# Altium project RFID_P5.PrjPcb (part 2 of 2)

## Sheet Power_CU Schematic.SchDoc: Title
size A3; SheetTitle: Power Supply Schematic; ApprovalDate: dd/mm/yyyy; PageSetup: Record=PageOptions|CenterHorizontal=True|CenterVertical=True|PrintScale=1.01|XCorrection=1.00|YCorrection=1.00|PrintKind=1|BorderSize=5000000|LeftOffset=0|BottomOffset=0|Orientation=2|PaperLength=1000|PaperWidth=1000|Scale=100|PaperSource=7|PrintQuality=600|MediaType=1|DitherType=10|PaperKind=A3 (297 x 420mm)|PrintScaleMode=1; Title2: Power Schematic; Date: *******; ApprovedBy: *******; CheckedBy: None; Author: *******; CompanyName: *******; DrawnBy: Name; Engineer: *******; Organization: *******; Address1: *******; Address2: *******; Address3: *******; Address4: *******; DocumentNumber: Doc Num; Revision: *******; SheetNumber: 1; SheetTotal: *******; CurrentTime: *******; CurrentDate: *******; Time: *******; DocumentFullPathAndName: *******; DocumentName: *******; ModifiedDate: *******; ImagePath: *******; ProjectName: *******; Application_BuildNumber: *******
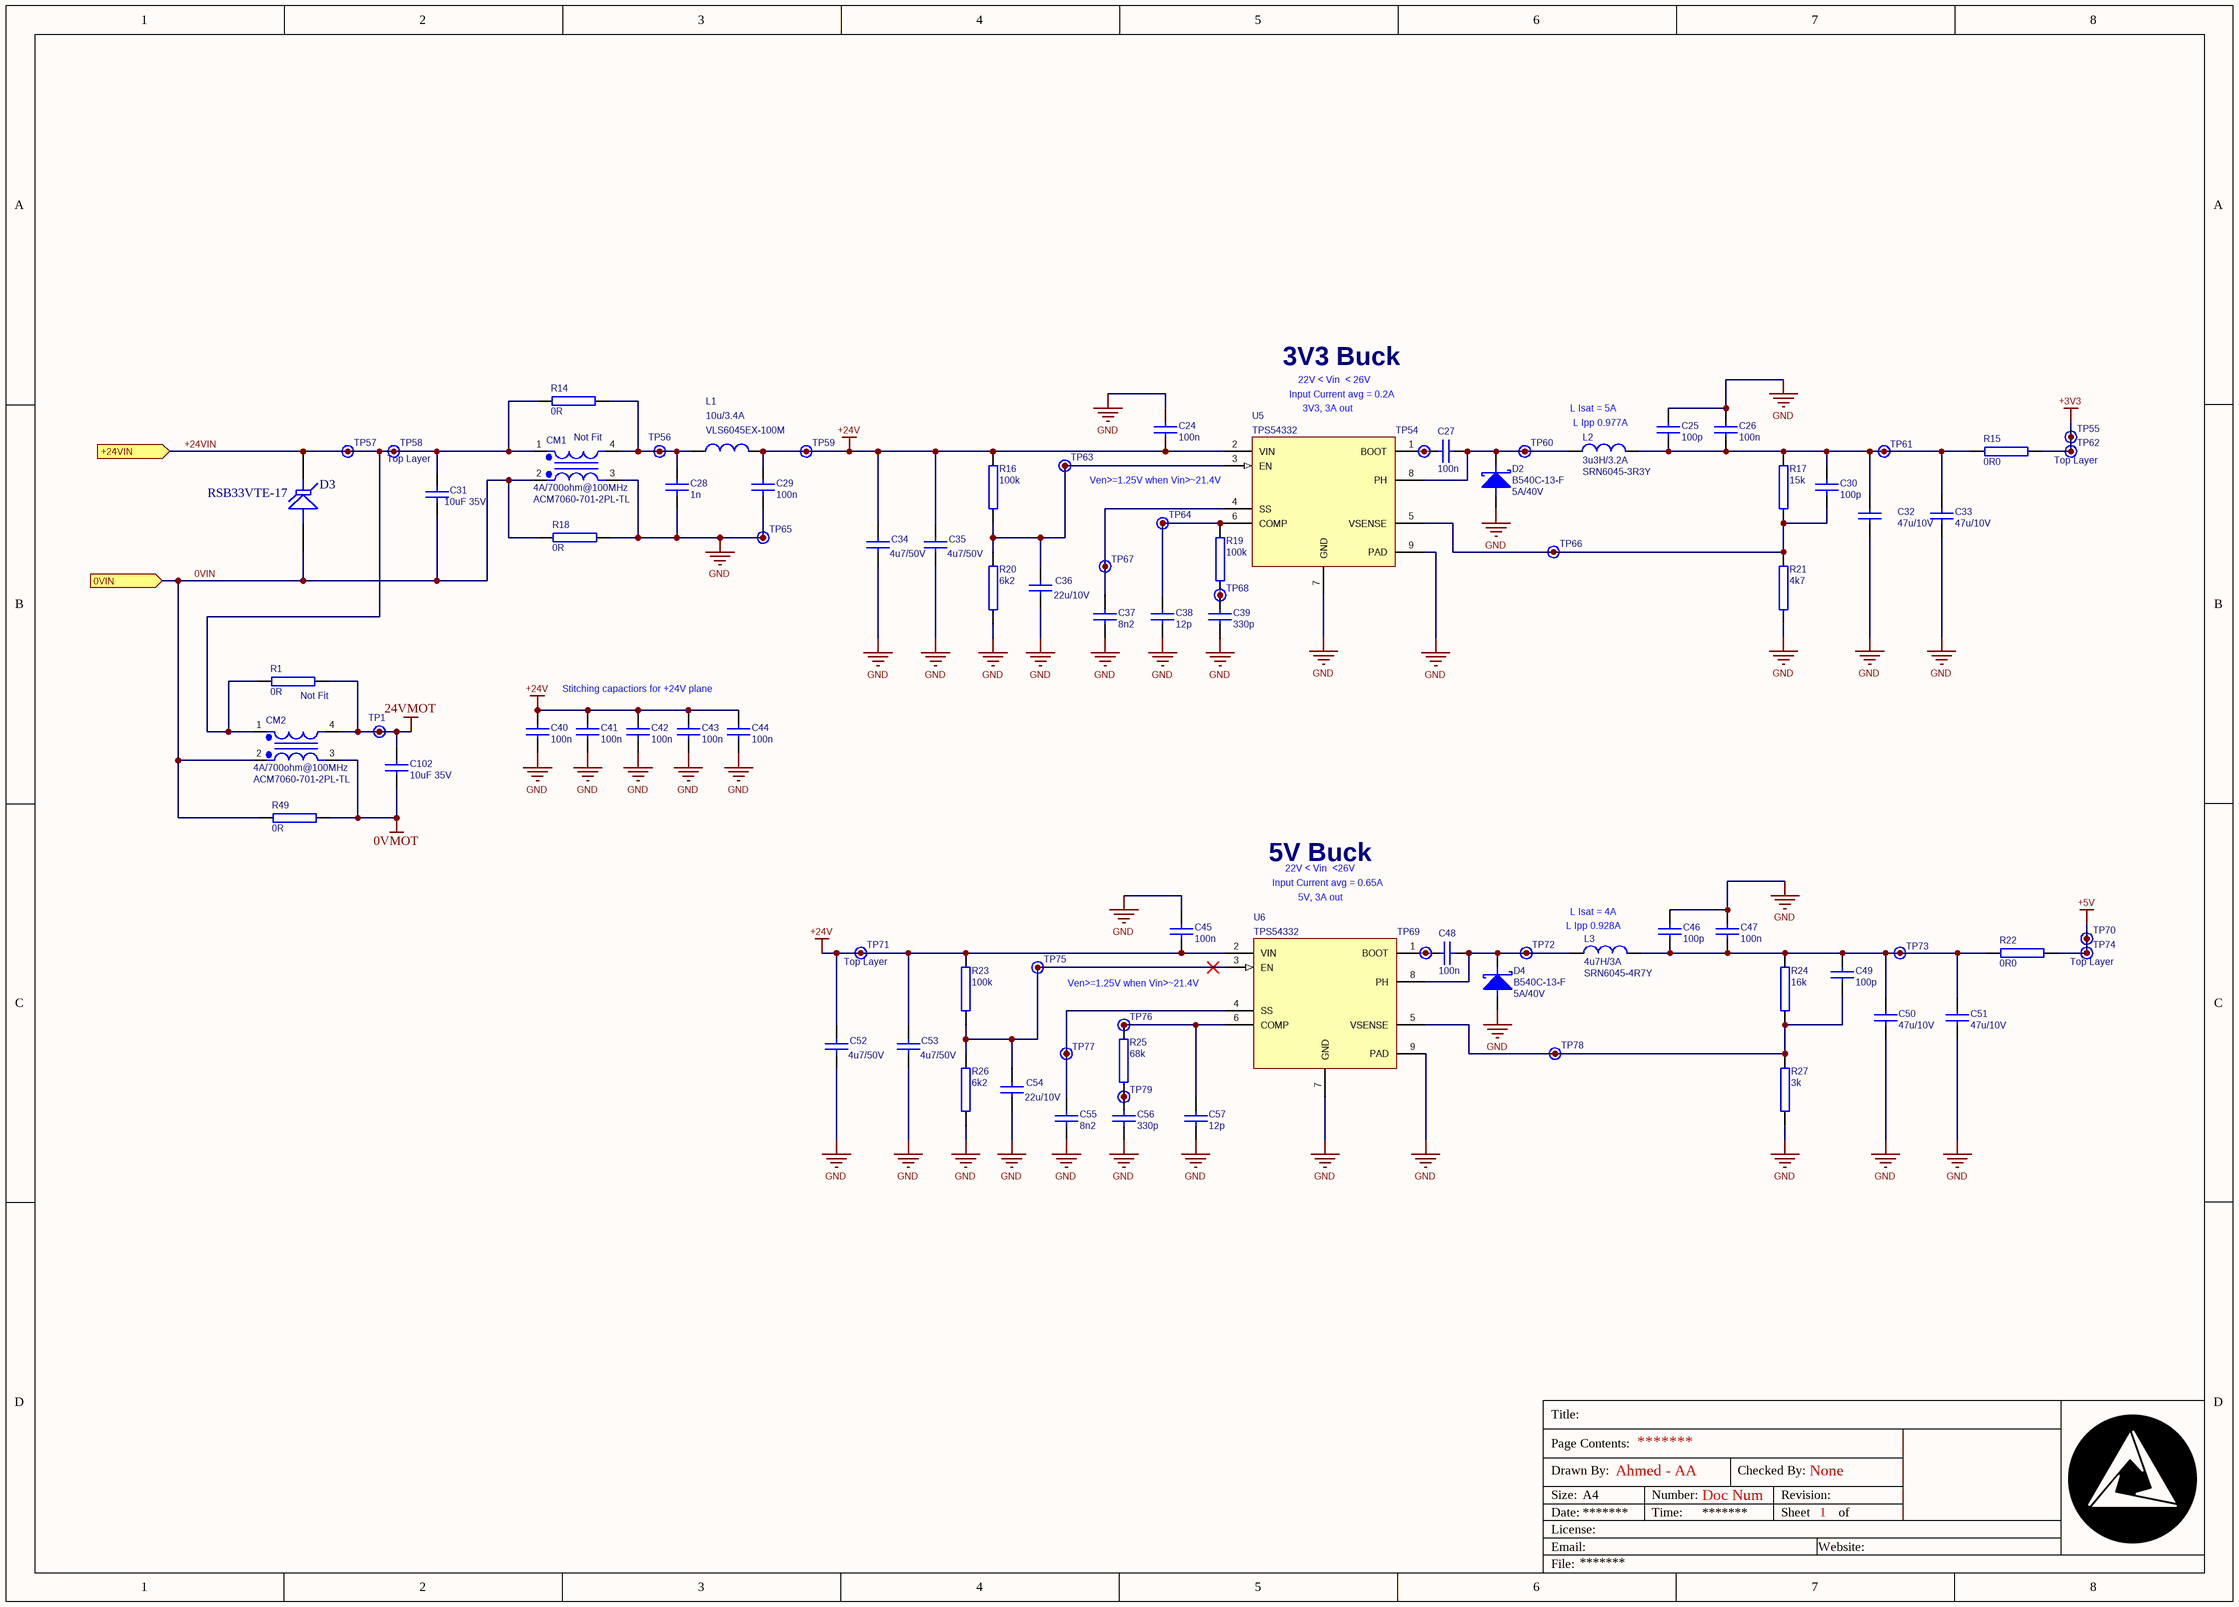
[diagram p4: Power_CU Schematic.SchDoc]

### Parts
C24  100n  [CAPC1608X09N(0603)]
C25  100p  [CAPC1608X09N(0603)]
C26  100n  [CAPC1608X09N(0603)]
C27  100n  [CAPC1608X09N(0603)]
C28  1n  [CAPC1608X09N(0603)]
C29  100n  [CAPC1608X09N(0603)]
C30  100p  [CAPC1608X09N(0603)]
C31  10uF 35V  [CAPC1608X09N(0603)]
C32  47u/10V  [CAPC2012X13N(0805)]
C33  47u/10V  [CAPC2012X13N(0805)]
C34  04 Value: 4u7/50V  [CAPC3216X16N(1206)]  (hidden comment: Cin)
C35  04 Value: 4u7/50V  [CAPC3216X16N(1206)]  (hidden comment: Cin)
C36  22u/10V  [CAPC1608X09N(0603)]
C37  8n2  [CAPC1608X09N(0603)]
C38  12p  [CAPC1608X09N(0603)]
C39  330p  [CAPC1608X09N(0603)]
C40  100n  [CAPC1608X09N(0603)]
C41  100n  [CAPC1608X09N(0603)]
C42  100n  [CAPC1608X09N(0603)]
C43  100n  [CAPC1608X09N(0603)]
C44  100n  [CAPC1608X09N(0603)]
C45  100n  [CAPC1608X09N(0603)]
C46  100p  [CAPC1608X09N(0603)]
C47  100n  [CAPC1608X09N(0603)]
C48  100n  [CAPC1608X09N(0603)]
C49  100p  [CAPC1608X09N(0603)]
C50  47u/10V  [CAPC2012X13N(0805)]
C51  47u/10V  [CAPC2012X13N(0805)]
C52  04 Value: 4u7/50V  [CAPC3216X16N(1206)]  (hidden comment: Cin)
C53  04 Value: 4u7/50V  [CAPC3216X16N(1206)]  (hidden comment: Cin)
C54  22u/10V  [CAPC1608X09N(0603)]
C55  8n2  [CAPC1608X09N(0603)]
C56  330p  [CAPC1608X09N(0603)]
C57  12p  [CAPC1608X09N(0603)]
C102  10uF 35V  [CAPC1608X09N(0603)]
CM1  4A/700ohm@100MHz  07 Assembly Options: Not Fit  [ACM7060-701-2PL-TL]
CM2  4A/700ohm@100MHz  07 Assembly Options: Not Fit  [ACM7060-701-2PL-TL]
D2  B540C-13-F  04 Value: 5A/40V  [B540C]
D3  RSB33VTE-17  [425]
D4  B540C-13-F  04 Value: 5A/40V  [B540C]
L1  10u/3.4A  02 Part Number: VLS6045EX-100M  [VLP6045LT-100M]
L2  3u3H/3.2A  [SRN6045-1R0Y]
L3  4u7H/3A  [SRN6045-1R0Y]
R1  0R  [RESC3116X07N(1206)]
R14  0R  [RESC3116X07N(1206)]
R15  0R0  [RESC1608X06N(0603)]
R16  100k  [RESC1608X06N(0603)]
R17  15k  [RESC1608X06N(0603)]
R18  0R  [RESC3116X07N(1206)]
R19  100k  [RESC1608X06N(0603)]
R20  6k2  [RESC1608X06N(0603)]
R21  4k7  [RESC1608X06N(0603)]
R22  0R0  [RESC1608X06N(0603)]
R23  100k  [RESC1608X06N(0603)]
R24  16k  [RESC1608X06N(0603)]
R25  68k  [RESC1608X06N(0603)]
R26  6k2  [RESC1608X06N(0603)]
R27  3k  [RESC1608X06N(0603)]
R49  0R  [RESC3116X07N(1206)]
TP1  LFX_P  [Test Point 1mm]  (value not drawn)  (no BOM)
TP54  LFX_P  [Test Point 1mm]  (value not drawn)  (no BOM)
TP55  LFX_P  [Test Point 1mm]  (value not drawn)  (no BOM)
TP56  LFX_P  [Test Point 1mm]  (value not drawn)  (no BOM)
TP57  LFX_P  [Test Point 1mm]  (value not drawn)  (no BOM)
TP58  Notes: Top Layer  [Test Point 1mm]  (hidden comment: LFX_P)  (no BOM)
TP59  LFX_P  [Test Point 1mm]  (value not drawn)  (no BOM)
TP60  LFX_P  [Test Point 1mm]  (value not drawn)  (no BOM)
TP61  LFX_P  [Test Point 1mm]  (value not drawn)  (no BOM)
TP62  Notes: Top Layer  [Test Point 1mm]  (hidden comment: LFX_P)  (no BOM)
TP63  LFX_P  [Test Point 1mm]  (value not drawn)  (no BOM)
TP64  LFX_P  [Test Point 1mm]  (value not drawn)  (no BOM)
TP65  LFX_P  [Test Point 1mm]  (value not drawn)  (no BOM)
TP66  LFX_P  [Test Point 1mm]  (value not drawn)  (no BOM)
TP67  LFX_P  [Test Point 1mm]  (value not drawn)  (no BOM)
TP68  LFX_P  [Test Point 1mm]  (value not drawn)  (no BOM)
TP69  LFX_P  [Test Point 1mm]  (value not drawn)  (no BOM)
TP70  LFX_P  [Test Point 1mm]  (value not drawn)  (no BOM)
TP71  Notes: Top Layer  [Test Point 1mm]  (hidden comment: LFX_P)  (no BOM)
TP72  LFX_P  [Test Point 1mm]  (value not drawn)  (no BOM)
TP73  LFX_P  [Test Point 1mm]  (value not drawn)  (no BOM)
TP74  Notes: Top Layer  [Test Point 1mm]  (hidden comment: LFX_P)  (no BOM)
TP75  LFX_P  [Test Point 1mm]  (value not drawn)  (no BOM)
TP76  LFX_P  [Test Point 1mm]  (value not drawn)  (no BOM)
TP77  LFX_P  [Test Point 1mm]  (value not drawn)  (no BOM)
TP78  LFX_P  [Test Point 1mm]  (value not drawn)  (no BOM)
TP79  LFX_P  [Test Point 1mm]  (value not drawn)  (no BOM)
U5  TPS54332  [SOIC127P600X170_HS-9N_b]
U6  TPS54332  [SOIC127P600X170_HS-9N_b]

### Ports
0VIN (in), +24VIN (in)

### Nets
0VMOT: C102.1 CM2.3 R49.2
24VMOT: C102.2 CM2.4 R1.2 TP1.TP
+3V3: R15.2 TP55.TP TP62.TP
+5V: R22.2 TP70.TP TP74.TP
+24V: C24.2 C29.1 C34.2 C35.2 C40.1 C41.1 C42.1 C43.1 C44.1 C45.2 C52.2 C53.2 L1.2 R16.2 R23.2 TP59.TP TP71.TP U5.2(VIN) U6.2(VIN)
GND: C24.1 C25.1 C26.1 C28.1 C29.2 C32.1 C33.1 C34.1 C35.1 C36.1 C37.1 C38.1 C39.1 C40.2 C41.2 C42.2 C43.2 C44.2 C45.1 C46.1 C47.1 C50.1 C51.1 C52.1 C53.1 C54.1 C55.1 C56.1 C57.1 CM1.3 D2.A D4.A R18.2 R20.1 R21.1 R26.1 R27.1 TP65.TP U5.7(GND) U5.9(PAD) U6.7(GND) U6.9(PAD)  [project net AN GND]
0VIN: C31.1 CM1.2 CM2.2 D3.1(A) R18.1 R49.1 ; port 0VIN
+24VIN: C31.2 CM1.1 CM2.1 D3.2(K) R1.1 R14.1 TP57.TP TP58.TP ; port +24VIN
NetC25_2: C25.2 C26.2 C30.1 C32.2 C33.2 L2.2 R15.1 R17.2 TP61.TP
NetC27_1: C27.1 D2.K L2.1 TP60.TP U5.8(PH)
NetC27_2: C27.2 TP54.TP U5.1(BOOT)
NetC28_2: C28.2 CM1.4 L1.1 R14.2 TP56.TP
NetC30_2: C30.2 R17.1 R21.2 TP66.TP U5.5(VSENSE)
NetC36_2: C36.2 R16.1 R20.2 TP63.TP U5.3(EN)
NetC37_2: C37.2 TP67.TP U5.4(SS)
NetC38_2: C38.2 R19.2 TP64.TP U5.6(COMP)
NetC39_2: C39.2 R19.1 TP68.TP
NetC46_2: C46.2 C47.2 C49.1 C50.2 C51.2 L3.2 R22.1 R24.2 TP73.TP
NetC48_1: C48.1 D4.K L3.1 TP72.TP U6.8(PH)
NetC48_2: C48.2 TP69.TP U6.1(BOOT)
NetC49_2: C49.2 R24.1 R27.2 TP78.TP U6.5(VSENSE)
NetC54_2: C54.2 R23.1 R26.2 TP75.TP U6.3(EN)
NetC55_2: C55.2 TP77.TP U6.4(SS)
NetC56_2: C56.2 R25.1 TP79.TP
NetC57_2: C57.2 R25.2 TP76.TP U6.6(COMP)

### Notes on the sheet
- 22V < Vin  < 26V
- 3V3 Buck
- Input Current avg = 0.2A
- Ven>=1.25V when Vin>~21.4V
- (near U5) 3V3, 3A out
- L Isat = 5A
- L Ipp 0.977A
- Stitching capactiors for +24V plane
- 5V Buck
- (near U6) 5V, 3A out
- 22V < Vin  <26V
- Input Current avg = 0.65A
- L Isat = 4A
- (near L3) L Ipp 0.928A
- Title:
- Drawn By:
- Page Contents:
- Ahmed - AA
- Checked By:
- Size:
- Date:
- File:
- License:
- Email:
- A4
- Number:
- Time:
- Revision:
- Sheet
- Website:
- of

### Library data of the parts
C24 C26 C27 C29 C40-C45 C47 C48 = GRM188R71H104KA93D: as C62 on sheet RFID_CU Schematic; 02 Part Number: GRM188R71H104KA93D; 03 Description: Capacitor, Ceramic, 50V, ±10%, X7R, -55°C to 125°C; 04 Value: 100n; 01 Part Category: Capacitor; 09 Digikey PN: 490-1519-2-ND; ComponentLink1Description: Datasheet; ComponentLink1URL: L:\Datasheet\Capacitor\c02e.pdf
C25 C30 C46 C49 = GRM1885C1H101JA01D: Capacitor, Ceramic, 50V, ±5%, C0G NP0, -55°C to 125°C; 08 Manufacturer: Murata Electronics North America; 06 Package: 0603; 12 Author: D.Grace; 05 Footprint Type: SMD; 02 Part Number: GRM1885C1H101JA01D; 03 Description: Capacitor, Ceramic, 50V, ±5%, C0G NP0, -55°C to 125°C; 04 Value: 100p; 01 Part Category: Capacitor; 09 Digikey PN: 490-1427-2-ND; 10 Alternate Supplier: Mouser; 11 Alternate Supplier PN: 81-GRM39C101J50; ComponentLink1Description: Datasheet; ComponentLink1URL: L:\Datasheet\Capacitor\c02e.pdf
C28 = GRM1885C1H102JA01D: as C12 on sheet MCU_CU Schematic; 02 Part Number: GRM1885C1H102JA01D; 03 Description: Capacitor, Ceramic, 50V, ±5%, C0G NP0, -55°C to 125°C; 04 Value: 1n; 01 Part Category: Capacitor; 09 Digikey PN: 490-1451-2-ND; ComponentLink1Description: Datasheet; ComponentLink1URL: L:\Datasheet\Capacitor\c02e.pdf
C31 = GRM1885C1H102JA01D: Capacitor, Ceramic, 50V, ±20%,; 06 Package: 0603; 12 Author: D.Grace; 05 Footprint Type: SMD; 02 Part Number: GRM1885C1H102JA01D; 03 Description: Capacitor, Ceramic, 50V, ±20%; 04 Value: 10uF; 01 Part Category: Capacitor; ComponentLink1Description: Datasheet
C32 C33 C50 C51 = C2012X5R1A476M125AC: Capacitor, Ceramic, 10V, ±20%, X5R, -55°C to 85°C; 08 Manufacturer: TDK; 04 Value: 47u; 06 Package: 0805; 12 Author: K.Sukumar; 05 Footprint Type: SMD; 02 Part Number: C2012X5R1A476M125AC; 03 Description: Capacitor, Ceramic, 10V, ±20%, X5R, -55°C to 85°C; 01 Part Category: Capacitor; 09 Digikey PN: 445-8239-2-ND; ComponentLink1Description: Datasheet; ComponentLink1URL: L:\Datasheet\Capacitor\mlcc_commercial_general_en.pdf
C34 C35 C52 C53 = GRM31CR71H475KA12L: Capacitor, Ceramic, 50V, ±10%, X7R, -55°C to 125°C; 08 Manufacturer: Murata Electronics North America; 06 Package: 1206; 12 Author: D.Grace; 05 Footprint Type: SMD; 02 Part Number: GRM31CR71H475KA12L; 03 Description: Capacitor, Ceramic, 50V, ±10%, X7R, -55°C to 125°C; 01 Part Category: Capacitor; 09 Digikey PN: 490-6521-2-ND; ComponentLink1Description: Datasheet; ComponentLink1URL: L:\Datasheet\Capacitor\c02e.pdf
C36 C54 = C1608X5R1A226M080AC: Capacitor, Ceramic, 10V, ±20%, X5R, -55°C to 85°C; 08 Manufacturer: TDK Corporation; 04 Value: 22u; 06 Package: 0603; 12 Author: K.Sukumar; 05 Footprint Type: SMD; 02 Part Number: C1608X5R1A226M080AC; 03 Description: Capacitor, Ceramic, 10V, ±20%, X5R, -55°C to 85°C; 01 Part Category: Capacitor; 09 Digikey PN: 445-9077-2-ND; ComponentLink1Description: Datasheet; ComponentLink1URL: L:\Datasheet\Capacitor\mlcc_commercial_general_en.pdf
C37 C55 = GRM188R71H822KA01D: Capacitor, Ceramic, 50V, ±10%, X7R, -55°C to 125°C; 08 Manufacturer: Murata Electronics North America; 06 Package: 0603; 12 Author: D.Grace; 05 Footprint Type: SMD; 02 Part Number: GRM188R71H822KA01D; 03 Description: Capacitor, Ceramic, 50V, ±10%, X7R, -55°C to 125°C; 04 Value: 8n2; 01 Part Category: Capacitor; 09 Digikey PN: 490-1510-2-ND; 10 Alternate Supplier: Mouser; 11 Alternate Supplier PN: 81-GRM39X822K50D; ComponentLink1Description: Datasheet; ComponentLink1URL: L:\Datasheet\Capacitor\c02e.pdf
C38 C57 = GRM1885C1H120JA01D: Capacitor, Ceramic, 50V, ±5%, C0G NP0, -55°C to 125°C; 08 Manufacturer: Murata Electronics North America; 06 Package: 0603; 12 Author: D.Grace; 05 Footprint Type: SMD; 02 Part Number: GRM1885C1H120JA01D; 03 Description: Capacitor, Ceramic, 50V, ±5%, C0G NP0, -55°C to 125°C; 04 Value: 12p; 01 Part Category: Capacitor; 09 Digikey PN: 490-1405-2-ND; 10 Alternate Supplier: Mouser; 11 Alternate Supplier PN: 81-GRM39C120J50; ComponentLink1Description: Datasheet; ComponentLink1URL: L:\Datasheet\Capacitor\c02e.pdf
C39 C56 = GRM188R71H331KA01D: Capacitor, Ceramic, 50V, ±10%, X7R, -55°C to 125°C; 08 Manufacturer: Murata Electronics North America; 06 Package: 0603; 12 Author: M.Fineschi; 05 Footprint Type: SMD; 02 Part Number: GRM188R71H331KA01D; 03 Description: Capacitor, Ceramic, 50V, ±10%, X7R, -55°C to 125°C; 04 Value: 330p; 01 Part Category: Capacitor; 09 Digikey PN: 490-1486-1-ND; ComponentLink1Description: Datasheet; ComponentLink1URL: L:\Datasheet\Capacitor\c02e.pdf
C102 = GRM1885C1H102JA01D: Capacitor, Ceramic, 50V, ±5%, C0G NP0, -55°C to 125°C; 03 Description: Capacitor, Ceramic, 35V, ±20%; 06 Package: 0603; 05 Footprint Type: SMD; 04 Value: 10uF 35V; 01 Part Category: Capacitor; ComponentLink1Description: Datasheet
CM1 CM2 = ACM7060-701-2PL-TL: Common Mode Choke, 4A, 500ohm min 700ohm typ @100MHz, 15mOhm Max,; 01 Part Category: Filter; 08 Manufacturer: TDK Corporation; 06 Package: 7x6x3.5mm; 05 Footprint Type: SMD; 12 Author: D.Grace; 03 Description: Common Mode Choke, 4A, 500ohm min 700ohm typ @100MHz, 15mOhm Max,; 04 Value: 700ohm@100MHz; ComponentLink1Description: Datasheet; ComponentLink1URL: L:\Datasheet\Filter\ACM Series.pdf; 02 Part Number: ACM7060-701-2PL-TL; 09 Digikey PN: 445-2215-2-ND
D2 D4 = B540C-13-F: Diode, Schottky, Fast Recovery, 550mV @ 5A, 40V, 5A,  500ns, -55°C - +125°C; 01 Part Category: Protection; 08 Manufacturer: Diodes Inc; 06 Package: SMC; 05 Footprint Type: SMD; 12 Author: J.McLachlan; 03 Description: Diode, Schottky, Fast Recovery, 550mV @ 5A, 40V, 5A,  500ns, -55°C - +125°C; ComponentLink1Description: Datasheet; ComponentLink1URL: L:\Datasheet\Protection\ds13012.pdf; 09 Digikey PN: B540C-FDITR-ND; 02 Part Number: B540C-13-F
D3 = Tranzorb: Transient Voltage Suppression (TVS) Diode; Published: 24-Mar-1999; LatestRevisionDate: 17-Jul-2002; LatestRevisionNote: Re-released for DXP Platform.; PackageReference: DO-7; Publisher: Altium Limited; PackageDescription: Axial Lead Diode
L1 = VLP6045LT-100M: Inductor, 10µH , 3.4A rated, 3.9A Saturation,61mOhm; 08 Manufacturer: TDK Corporation; 04 Value: 10uH; 06 Package: Custom; 05 Footprint Type: SMD; 12 Author: M.Fineschi; 03 Description: Inductor, 10µH , 3.4A rated, 3.9A Saturation, 61mOhm; 01 Part Category: Inductor; ComponentLink1Description: Datasheet; ComponentLink1URL: https://product.tdk.com/info/en/catalog/datasheets/inductor_commercial_power_vls6045ex_en.pdf; 09 Digikey PN: 445-173039-1-ND
L2 = SRN6045-3R3Y: Inductor, 3u3H , I = 3.2A, 30.2mOhm, SRF 27MHz, ±30%, 5A Saturation; 01 Part Category: Passive; 08 Manufacturer: Bourns Inc; 06 Package: 6mm x 6mm; 05 Footprint Type: SMD; 12 Author: J.McLachlan; 03 Description: Inductor, 3u3H , I = 3.2A, 30.2mOhm, SRF 27MHz, ±30%, 5A Saturation; 04 Value: 3u3H; ComponentLink1Description: Datasheet; ComponentLink1URL: L:\Datasheet\Inductor\SRN6045.pdf; 09 Digikey PN: SRN6045-3R3YTR-ND; 02 Part Number: SRN6045-3R3Y
L3 = SRN6045-4R7Y: Inductor, 4u7H , I = 3A, 37.6mOhm, SRF 22MHz, ±30%, 4A Saturation; 01 Part Category: Passive; 08 Manufacturer: Bourns Inc; 06 Package: 6mm x 6mm; 05 Footprint Type: SMD; 12 Author: J.McLachlan; 03 Description: Inductor, 4u7H , I = 3A, 37.6mOhm, SRF 22MHz, ±30%, 4A Saturation; 04 Value: 4u7H; ComponentLink1Description: Datasheet; ComponentLink1URL: L:\Datasheet\Inductor\SRN6045.pdf; 09 Digikey PN: SRN6045-4R7YTR-ND; 02 Part Number: SRN6045-4R7Y
R1 R14 R18 R49 = RC1206JR-070RL: Resistor, Thick Film, 0.25W, ±1%, ±100ppm/°C; 08 Manufacturer: Yageo; 06 Package: 1206; 12 Author: M.Fineschi; 05 Footprint Type: SMD; 03 Description: Resistor, Thick Film, 0.25W, ±1%, ±100ppm/°C; 04 Value: 0R; 09 Digikey PN: 311-0.0ERTR-ND; 01 Part Category: Resistor; ComponentLink1Description: Datasheet; ComponentLink1URL: L:\Datasheet\Resistor\PYu-RC1206_51_RoHS_L-4.pdf; 02 Part Number: RC1206JR-070RL
R15 R22 = RC1608J000CS: Resistor, Thick Film, 0.1W, ±1%, ±100ppm/°C; 08 Manufacturer: Samsung Electro-Mechanics; 13 Reviewed By: P.Moutzouris; 06 Package: 0603; 12 Author: K.Sukumar; 05 Footprint Type: SMD; 02 Part Number: RC1608J000CS; 03 Description: Resistor, Thick Film, 0.1W, ±1%, ±100ppm/°C; 04 Value: 0R0; 09 Digikey PN: 1276-3510-2-ND; 01 Part Category: Resistor; ComponentLink1Description: Datasheet; ComponentLink1URL: L:\Datasheet\Resistor\Chip_Resistor.pdf
R16 R19 R23 = RC0603FR-07100KL: Resistor, Thick Film, 0.1W, ±1%, ±100ppm/°C; 08 Manufacturer: Yageo; 13 Reviewed By: P.Moutzouris; 06 Package: 0603; 12 Author: D.Grace; 05 Footprint Type: SMD; 02 Part Number: RC0603FR-07100KL; 03 Description: Resistor, Thick Film, 0.1W, ±1%, ±100ppm/°C; 04 Value: 100k; 01 Part Category: Resistor; ComponentLink1Description: Datasheet; ComponentLink1URL: L:\Datasheet\Resistor\PYu-RC0603_51_RoHS_L_4.pdf
  R16 R23: 09 Digikey PN: P100KLCT-ND
  R19: 09 Digikey PN: 311-100KHRTR-ND
R17 = RC0603FR-0715KL: Resistor, Thick Film, 0.1W, ±1%, ±100ppm/°C; 08 Manufacturer: Yageo; 13 Reviewed By: P.Moutzouris; 06 Package: 0603; 12 Author: D.Grace; 05 Footprint Type: SMD; 02 Part Number: RC0603FR-0715KL; 03 Description: Resistor, Thick Film, 0.1W, ±1%, ±100ppm/°C; 04 Value: 15k; 09 Digikey PN: 311-15.0KHRTR-ND; 01 Part Category: Resistor; ComponentLink1Description: Datasheet; ComponentLink1URL: L:\Datasheet\Resistor\PYu-RC0603_51_RoHS_L_4.pdf
R20 R26 = RC0603FR-076K2L: Resistor, Thick Film, 0.1W, ±1%, ±100ppm/°C; 08 Manufacturer: Yageo; 13 Reviewed By: P.Moutzouris; 06 Package: 0603; 12 Author: D.Grace; 05 Footprint Type: SMD; 02 Part Number: RC0603FR-076K2L; 03 Description: Resistor, Thick Film, 0.1W, ±1%, ±100ppm/°C; 04 Value: 6k2; 09 Digikey PN: 311-6.20KHRTR-ND; 01 Part Category: Resistor; ComponentLink1Description: Datasheet; ComponentLink1URL: L:\Datasheet\Resistor\PYu-RC0603_51_RoHS_L_4.pdf
R21 = RC0603FR-074K7L: Resistor, Thick Film, 0.1W, ±1%, ±100ppm/°C; 08 Manufacturer: Yageo; 13 Reviewed By: P.Moutzouris; 06 Package: 0603; 12 Author: D.Grace; 05 Footprint Type: SMD; 02 Part Number: RC0603FR-074K7L; 03 Description: Resistor, Thick Film, 0.1W, ±1%, ±100ppm/°C; 04 Value: 4k7; 09 Digikey PN: 311-4.70KHRTR-ND; 01 Part Category: Resistor; ComponentLink1Description: Datasheet; ComponentLink1URL: L:\Datasheet\Resistor\PYu-RC0603_51_RoHS_L_4.pdf
R24 = RC0603FR-0716KL: Resistor, Thick Film, 0.1W, ±1%, ±100ppm/°C; 08 Manufacturer: Yageo; 13 Reviewed By: P.Moutzouris; 06 Package: 0603; 12 Author: D.Grace; 05 Footprint Type: SMD; 02 Part Number: RC0603FR-0716KL; 03 Description: Resistor, Thick Film, 0.1W, ±1%, ±100ppm/°C; 04 Value: 16k; 09 Digikey PN: 311-16.0KHRTR-ND; 01 Part Category: Resistor; ComponentLink1Description: Datasheet; ComponentLink1URL: L:\Datasheet\Resistor\PYu-RC0603_51_RoHS_L_4.pdf
R25 = RC0603FR-0768KL: Resistor, Thick Film, 0.1W, ±1%, ±100ppm/°C; 08 Manufacturer: Yageo; 13 Reviewed By: P.Moutzouris; 06 Package: 0603; 12 Author: D.Grace; 05 Footprint Type: SMD; 02 Part Number: RC0603FR-0768KL; 03 Description: Resistor, Thick Film, 0.1W, ±1%, ±100ppm/°C; 04 Value: 68k; 09 Digikey PN: 311-68.0KHRTR-ND; 01 Part Category: Resistor; ComponentLink1Description: Datasheet; ComponentLink1URL: L:\Datasheet\Resistor\PYu-RC0603_51_RoHS_L_4.pdf
R27 = RC0603FR-073KL: Resistor, Thick Film, 0.1W, ±1%, ±100ppm/°C; 08 Manufacturer: Yageo; 13 Reviewed By: P.Moutzouris; 06 Package: 0603; 12 Author: D.Grace; 05 Footprint Type: SMD; 02 Part Number: RC0603FR-073KL; 03 Description: Resistor, Thick Film, 0.1W, ±1%, ±100ppm/°C; 04 Value: 3k; 09 Digikey PN: 311-3.00KHRTR-ND; 01 Part Category: Resistor; ComponentLink1Description: Datasheet; ComponentLink1URL: L:\Datasheet\Resistor\PYu-RC0603_51_RoHS_L_4.pdf
TP1 TP54-TP79 = Test Point: 01 Part Category: PCB; 12 Author: D.Grace
U5 U6 = TPS54332: Step Down, Adjustable, Vomin = 0.8V, Vin = 3.5 - 28V, Fs = 1MHz, Io = 3.5A, -40  ~ 125C; 01 Part Category: IC; 08 Manufacturer: Texas Instruments; 06 Package: 8 SOIC; 05 Footprint Type: SMD; 12 Author: M.Fineschi; 02 Part Number: TPS54332; 03 Description: Step Down, Adjustable, Vomin = 0.8V, Vin = 3.5 - 28V, Fs = 1MHz, Io = 3.5A, -40  ~ 125C; 04 Value: TPS54332; ComponentLink1Description: Datasheet; ComponentLink1URL: L:\Datasheet\IC\tps54332.pdf; 09 Digikey PN: 296-24141-5-ND

## Sheet Connector_CU Schematic.SchDoc: Title
size A3; ApprovalDate: dd/mm/yyyy; PartName: RFID_P5 CU board; PageSetup: Record=PageOptions|CenterHorizontal=True|CenterVertical=True|PrintScale=1.01|XCorrection=1.00|YCorrection=1.00|PrintKind=1|BorderSize=5000000|LeftOffset=0|BottomOffset=0|Orientation=2|PaperLength=1000|PaperWidth=1000|Scale=100|PaperSource=7|PrintQuality=600|MediaType=1|DitherType=10|PaperKind=A3 (297 x 420mm)|PrintScaleMode=1; Title2: Connector_CU Schematic; Date: *******; ApprovedBy: *******; CheckedBy: None; Author: *******; CompanyName: *******; DrawnBy: Name; Engineer: *******; Organization: *******; Address1: *******; Address2: *******; Address3: *******; Address4: *******; DocumentNumber: Doc Num; Revision: *******; SheetNumber: 1; SheetTotal: *******; CurrentTime: *******; CurrentDate: *******; Time: *******; DocumentFullPathAndName: *******; DocumentName: *******; ModifiedDate: *******; ImagePath: *******; ProjectName: *******; Application_BuildNumber: *******
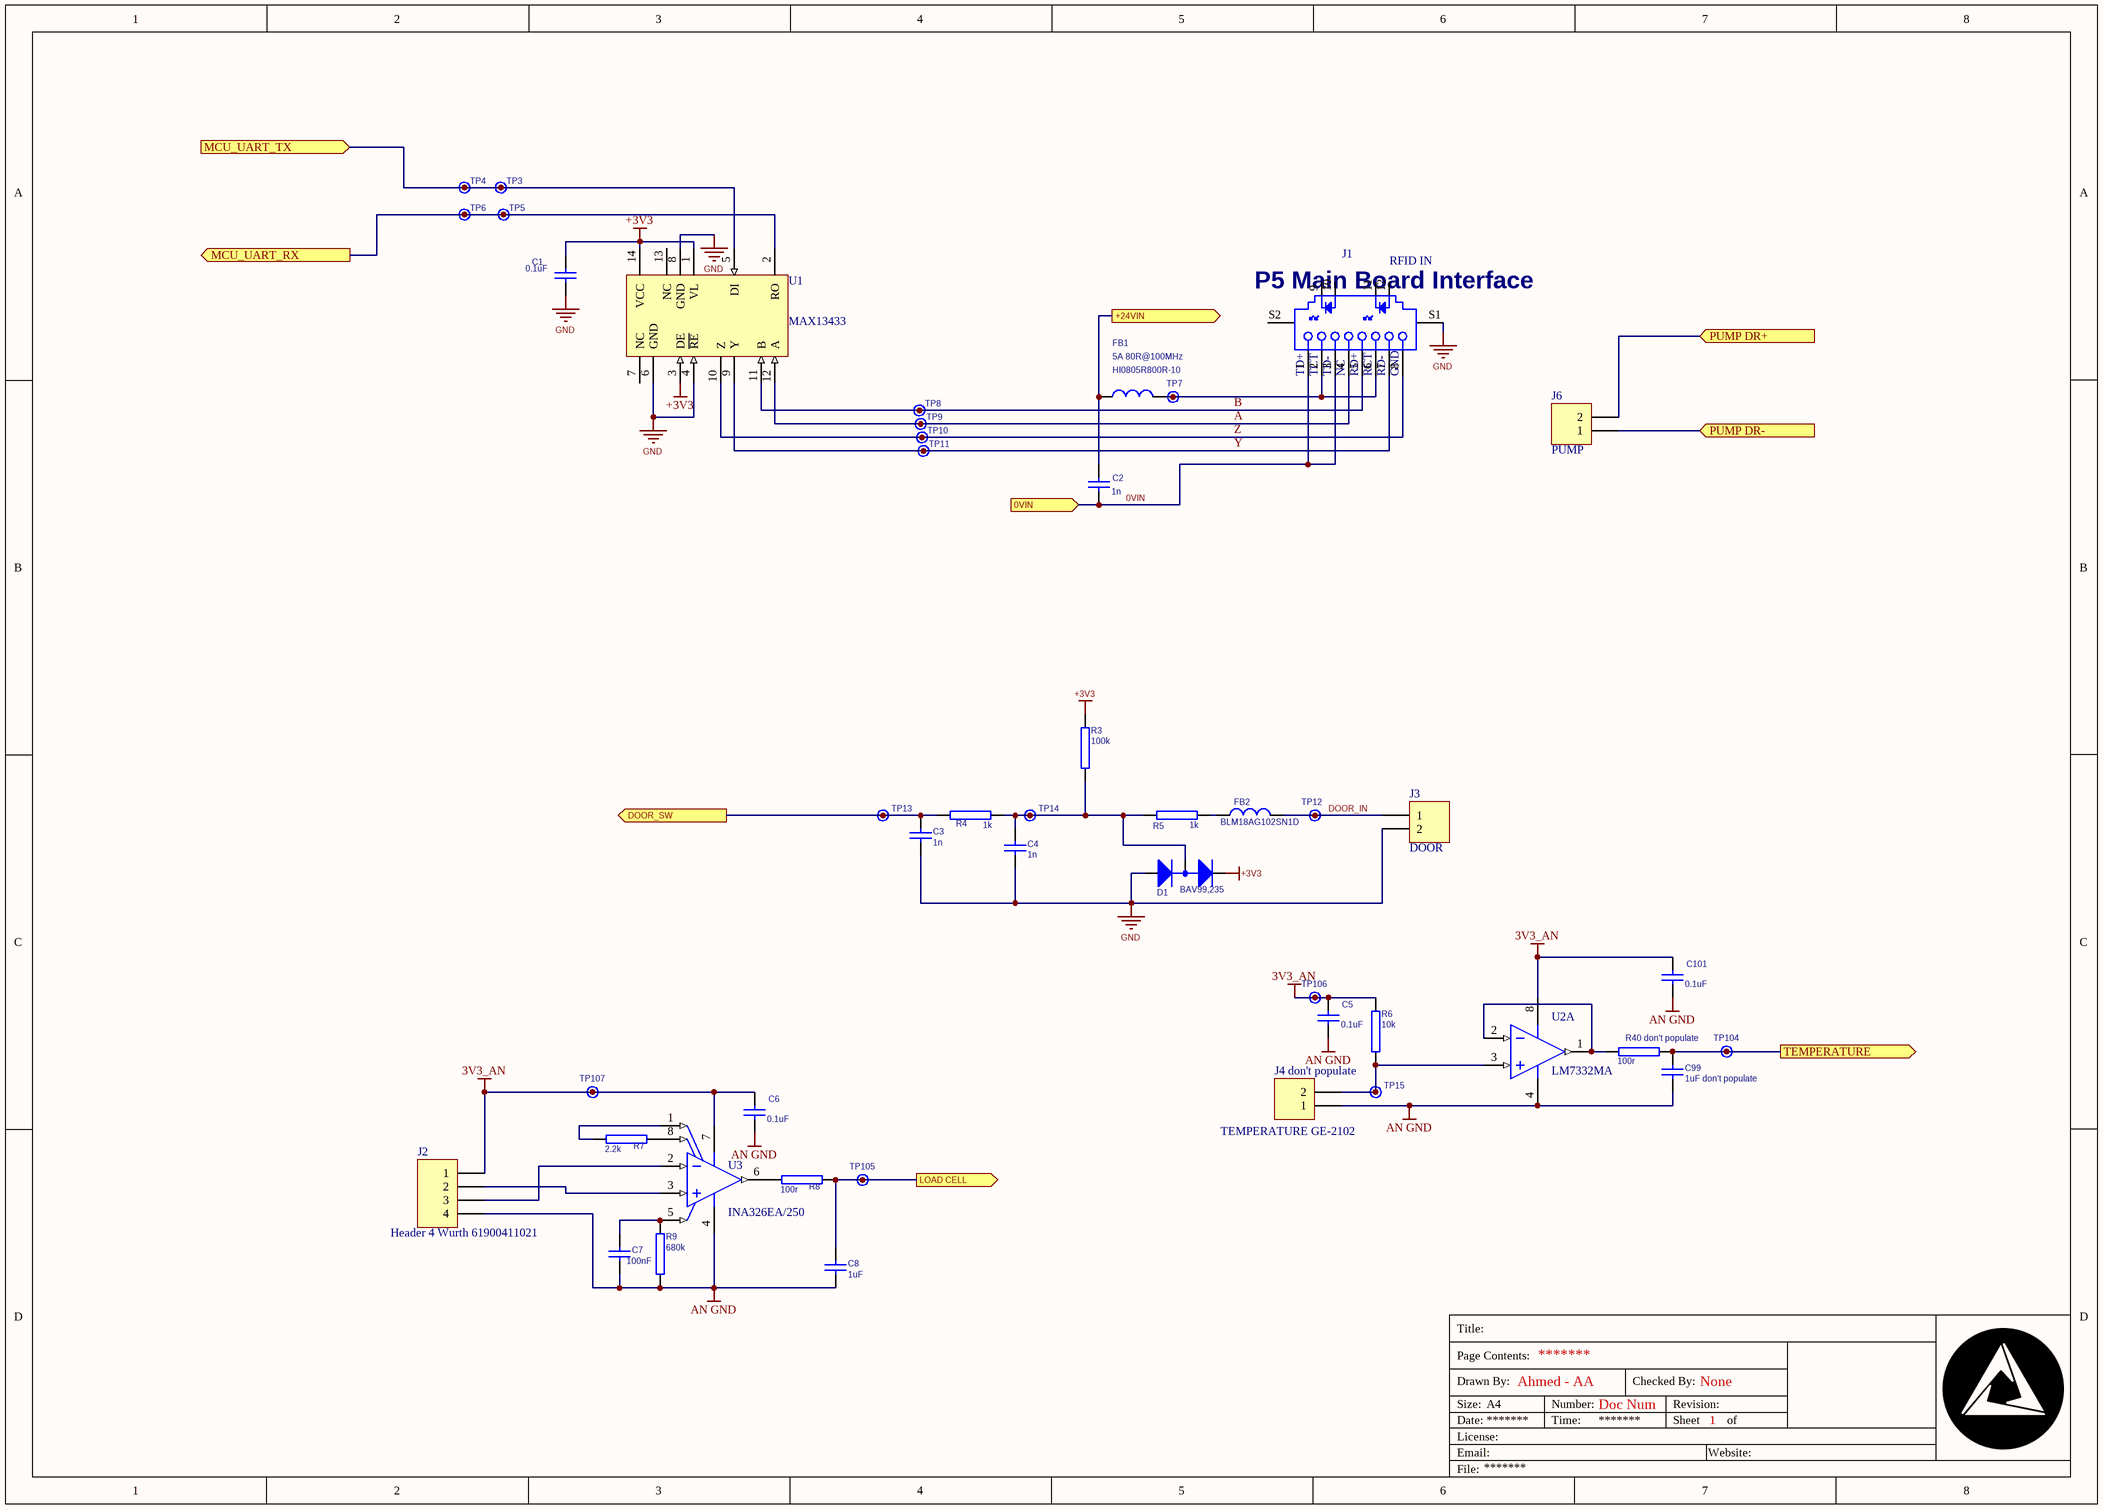
[diagram p5: Connector_CU Schematic.SchDoc]

### Parts
C1  0.1uF  [CAPC1608X09N(0603)]
C2  1n  [CAPC1608X09N(0603)]
C3  1n  [CAPC1608X09N(0603)]
C4  1n  [CAPC1608X09N(0603)]
C5  0.1uF  [CAPC1608X09N(0603)]
C6  0.1uF  [CAPC1608X09N(0603)]
C7  100nF  [CAPC1608X09N(0603)]
C8  1uF  [CAPC1608X09N(0603)]
C99  1uF don't populate  [CAPC1608X09N(0603)]
C101  0.1uF  [CAPC1608X09N(0603)]
D1  BAV99,235  [SOT95P240X130-3N (SOT23-3) DUAL DIODE A_KA_K]
FB1  5A 80R@100MHz  [RESC2012X06N(0805)]
FB2  400mA 1kohm@100MHz  [RESC1608X06N]  (value not drawn)
J1  RFID IN  [AMPH-RJHSE-5381_V]
J2  Header 4 Wurth 61900411021  [S04B-XASS-1N-BN]
J3  DOOR  [S02B-XASS-1]
J4_don't_populate  TEMPERATURE GE-2102  [S02B-XASS-1]
J6  PUMP  [S02B-XASS-1]
R3  100k  [RESC1608X06N(0603)]
R4  1k  [RESC1608X06N(0603)]
R5  1k  [RESC1608X06N(0603)]
R6  10k  [RESC1608X06N(0603)]
R7  2.2k  [RESC1608X06N(0603)]
R8  100r  [RESC1608X06N(0603)]
R9  680k  [RESC1608X06N(0603)]
R40_don't_populate  100r  [RESC1608X06N(0603)]
TP3  LFX_P  [Test Point 1mm]  (value not drawn)  (no BOM)
TP4  LFX_P  [Test Point 1mm]  (value not drawn)  (no BOM)
TP5  LFX_P  [Test Point 1mm]  (value not drawn)  (no BOM)
TP6  LFX_P  [Test Point 1mm]  (value not drawn)  (no BOM)
TP7  LFX_P  [Test Point 1mm]  (value not drawn)  (no BOM)
TP8  LFX_P  [Test Point 1mm]  (value not drawn)  (no BOM)
TP9  LFX_P  [Test Point 1mm]  (value not drawn)  (no BOM)
TP10  LFX_P  [Test Point 1mm]  (value not drawn)  (no BOM)
TP11  LFX_P  [Test Point 1mm]  (value not drawn)  (no BOM)
TP12  LFX_P  [Test Point 1mm]  (value not drawn)  (no BOM)
TP13  LFX_P  [Test Point 1mm]  (value not drawn)  (no BOM)
TP14  LFX_P  [Test Point 1mm]  (value not drawn)  (no BOM)
TP15  LFX_P  [Test Point 1mm]  (value not drawn)  (no BOM)
TP104  LFX_P  [Test Point 1mm]  (value not drawn)  (no BOM)
TP105  LFX_P  [Test Point 1mm]  (value not drawn)  (no BOM)
TP106  LFX_P  [Test Point 1mm]  (value not drawn)  (no BOM)
TP107  LFX_P  [Test Point 1mm]  (value not drawn)  (no BOM)
U1  MAX13433  [S14_M]
U2  LM7332MA  [M08A_N]  (part A of 2)
U3  INA326EA/250  [DGK0008A_L]

### Ports
0VIN (in), +24VIN (out), DOOR_SW (out), LOAD CELL (out), MCU_UART_RX (out), MCU_UART_TX (in), PUMP DR+ (in), PUMP DR- (in), TEMPERATURE (out)

### Nets
3V3_AN: C5.2 C6.2 C101.2 J2.1 R6.2 TP106.TP TP107.TP U2.8(V+) U3.7(V+)
+3V3: C1.2 D1.K2 R3.2 U1.1(VL) U1.3(DE) U1.14(VCC)
AN GND: C1.1 C3.2 C4.2 C5.1 C6.1 C7.2 C8.2 C99.2 C101.1 D1.A1 J1.S1 J2.4 J3.2 J4_don't_populate.1 R9.1 U1.4(~{RE}) U1.6(GND) U1.8(GND) U2.4(V-) U3.4(V-)  [also labelled GND]
0VIN: C2.1 J1.1 J1.3 ; port 0VIN
+24VIN: C2.2 FB1.1 ; port +24VIN
A: J1.4 TP9.TP U1.12(A)
B: J1.5 TP8.TP U1.11(B)
DOOR_IN: FB2.2 J3.1 TP12.TP
Y: J1.7 TP11.TP U1.9(Y)
Z: J1.8 TP10.TP U1.10(Z)
NetC3_1: C3.1 R4.2 TP13.TP ; port DOOR_SW
NetC4_1: C4.1 D1.K1A2 R3.1 R4.1 R5.2 TP14.TP
NetC7_1: C7.1 R9.2 U3.5(R2)
NetC8_1: C8.1 R8.2 TP105.TP ; port LOAD CELL
NetC99_1: C99.1 R40_don't_populate.2 TP104.TP ; port TEMPERATURE
NetC108_1: J6.2 ; port PUMP DR+
NetFB1_2: FB1.2 J1.2 J1.6 TP7.TP
NetFB2_1: FB2.1 R5.1
NetJ2_2: J2.2 U3.3(VIN+)
NetJ2_3: J2.3 U3.2(VIN-)
NetJ4_don't_populate_2: J4_don't_populate.2 R6.1 TP15.TP U2.3(INA+)
NetJ6_1: J6.1 ; port PUMP DR-
NetR7_1: R7.1 U3.1(R1)
NetR7_2: R7.2 U3.8(R1)
NetR8_1: R8.1 U3.6(VO)
NetR40_don't_populate_1: R40_don't_populate.1 U2.1(OUTA) U2.2(INA-)
NetTP3_TP: TP3.TP TP4.TP U1.5(DI) ; port MCU_UART_TX
NetTP5_TP: TP5.TP TP6.TP U1.2(RO) ; port MCU_UART_RX

Not connected (* = marked no-connect by the designer): J1 9 10 11 12 S2; U1 7(NC) 13(NC)

### Notes on the sheet
- (near J1) P5 Main Board Interface
- Title:
- Drawn By:
- Page Contents:
- Ahmed - AA
- Checked By:
- Size:
- Date:
- File:
- License:
- Email:
- A4
- Number:
- Time:
- Revision:
- Sheet
- Website:
- of
- (in symbol CMP-2000-06980-1) TD+; TCT; TD-; NC; RD+; RCT; RD-; GND

### Library data of the parts
C1 = GQM1885C1H100JB01D: Capacitor, Ceramic, 50V, ±5%, NP0, -55°C to 125°C; 08 Manufacturer: Murata Electronics North America; 06 Package: 0603; 12 Author: M.Fineschi; 05 Footprint Type: SMD; 02 Part Number: GQM1885C1H100JB01D; 03 Description: Capacitor, Ceramic, 50V, ±5%, NP0, -55°C to 125°C; 04 Value: 0.1uF; 01 Part Category: Capacitor; 09 Digikey PN: 490-3570-1-ND; ComponentLink1Description: Datasheet; ComponentLink1URL: L:\Datasheet\Capacitor\c02e.pdf
C2-C4 C8 C99 = GRM1885C1H102JA01D: as C12 on sheet MCU_CU Schematic; 02 Part Number: GRM1885C1H102JA01D; 03 Description: Capacitor, Ceramic, 50V, ±5%, C0G NP0, -55°C to 125°C; 01 Part Category: Capacitor; 09 Digikey PN: 490-1451-2-ND; ComponentLink1Description: Datasheet; ComponentLink1URL: L:\Datasheet\Capacitor\c02e.pdf
  C2-C4: 04 Value: 1n
  C8 C99: 04 Value: 1uF
C5 C6 C101 = GRM188R71H104KA93D: Capacitor, Ceramic, 50V, ±10%, X7R, -55°C to 125°C; 08 Manufacturer: Murata Electronics North America; 04 Value: 100n; 06 Package: 0603; 12 Author: D.Grace; 05 Footprint Type: SMD; 02 Part Number: GRM188R71H104KA93D; 03 Description: Capacitor, Ceramic, 50V, ±10%, X7R, -55°C to 125°C; 01 Part Category: Capacitor; 09 Digikey PN: 490-1519-2-ND; ComponentLink1Description: Datasheet; ComponentLink1URL: L:\Datasheet\Capacitor\c02e.pdf
C7 = GRM1885C1H102JA01D: Capacitor, Ceramic, 50V, ±5%, C0G NP0, -55°C to 125°C; 08 Manufacturer: Murata Electronics North America; 04 Value: 1n; 06 Package: 0603; 12 Author: D.Grace; 05 Footprint Type: SMD; 02 Part Number: GRM1885C1H102JA01D; 03 Description: Capacitor, Ceramic, 50V, ±5%, C0G NP0, -55°C to 125°C; 01 Part Category: Capacitor; 09 Digikey PN: 490-1451-2-ND; ComponentLink1Description: Datasheet; ComponentLink1URL: L:\Datasheet\Capacitor\c02e.pdf
D1 = BAV99,235: Diodes, Vr = 100V, Io = 215mA, Vf = 1.25V, Tr = 4ns; 01 Part Category: Discreet; 08 Manufacturer: Fairchild Semiconductor; 06 Package: SOT-23-3; 12 Author: D.Grace; 05 Footprint Type: SMD; 02 Part Number: BAV99,235; 03 Description: Diodes, Vr = 100V, Io = 215mA, Vf = 1.25V, Tr = 4ns; 04 Value: BAV99,235; 09 Digikey PN: 568-5005-2-ND; ComponentLink1Description: Datasheet; ComponentLink1URL: L:\Datasheet\Discrete\BAV99_SER.pdf
FB1 = HI0805R800R-10: Ferrite Bead, 80 Ohm @ 100MHz, 5A, DC 10 mOhm Max, -55 °C to 125°C; 01 Part Category: Filter; 08 Manufacturer: Laird-Signal Integrity Products; 06 Package: 0805; 05 Footprint Type: SMD; 12 Author: L.Liu; 03 Description: Ferrite Bead, 80 Ohm @ 100MHz, 5A, DC 10 mOhm Max, -55 °C to 125°C; 04 Value: 80R@100MHz; ComponentLink1Description: Datasheet; ComponentLink1URL: I:\Engineering\Library\Datasheet\Filter\FerriteEMI_ChipBeads_br.pdf; 09 Digikey PN: 240-2395-2-ND; 02 Part Number: HI0805R800R-10
FB2 = BLM18AG102SN1D: Ferrite Bead, 1kohm@100MHz, 400mA, 500mohm, -55 to 125C; 01 Part Category: Filter; 08 Manufacturer: Murata; 06 Package: 0603; 05 Footprint Type: SMD; 12 Author: M.Fineschi; 02 Part Number: BLM18AG102SN1D; 03 Description: Ferrite Bead, 1kohm@100MHz, 400mA, 500mohm, -55 to 125C; 04 Value: 1kohm@100MHz; ComponentLink1Description: Datasheet; ComponentLink1URL: L:\Datasheet\Filter\L0110S0100BLM18A.pdf; 09 Digikey PN: 490-1015-2-ND; 10 Alternate Supplier: BLM18AG102SN1D
J1 = CMP-2000-06980-1: High Speed RJ45, Modular Jack, 8 Position, 8 Contacts, Shielded, with LEDs, -55 to 85 degC,12-Pin THD, RoHS, Tray; Manufacturer: Amphenol; Number of Positions/Contacts: 8p8c(RJ45,Ethernet); Number of Ports: 1; Catalog Drawings: RJ45SeriesRightAngle; PCN Design/Specification: MultipleSeriesCopper29/Jan/2009RJHSEShieldMaterial30/Jun/2015; Other Names: RJHSE5381; Online Catalog: RJHSESeries; Featured Product: ModularJacksProductSolutions; Tab Direction: Up; Shielding: Shielded,EMIFinger; LED Color: Yellow-Green; 3D Model: RJHSE538x.stpRJHSE538x.igs; Category: Connectors,Interconnects; Termination: Solder; Housing Material: Thermoplastic; Mounting Type: ThroughHole; Family: ModularConnectors-Jacks; Orientation: 90°Angle(Right); Features: BoardLock; Contact Material: PhosphorBronze; Mounting Technology: ThroughHole; Number of Rows: 1; Standard Package: 120; Ratings: -; Operating Temperature: -55°C~85°C; Series: RJHSE; Contact Finish: Gold; Package Reference: RJHSE-5381; Ingress Protection: -; Package Description: 12-Pin Through Hole Device, Body 16.51 x 15.75 mm; Contact Finish Thickness: 50µin(1.27µm); Datasheet URL: https://datasheet.ciiva.com/16481/rjhse538x-16481714.pdf; Datasheet Version: Rev. K, 04/2014; Connector Type: Jack; Manufacturer URL: http://www.amphenol.com/; Packaging: Tray
J2 = Header 4: Header, 4-Pin; LatestRevisionDate: 17-Jul-2002; LatestRevisionNote: Re-released for DXP Platform.; Publisher: Altium Limited
J3 J4_don't_populate J6 = Header 2: Header, 2-Pin; LatestRevisionDate: 17-Jul-2002; LatestRevisionNote: Re-released for DXP Platform.; Publisher: Altium Limited
R3 = RC0603FR-07100KL: as R16 on sheet Power_CU Schematic; 02 Part Number: RC0603FR-07100KL; 03 Description: Resistor, Thick Film, 0.1W, ±1%, ±100ppm/°C; 04 Value: 100k; 09 Digikey PN: 311-100KHRTR-ND; 01 Part Category: Resistor; ComponentLink1Description: Datasheet; ComponentLink1URL: L:\Datasheet\Resistor\PYu-RC0603_51_RoHS_L_4.pdf
R4 R5 = RC0603FR-071KL: Resistor, Thick Film, 0.1W, ±1%, ±100ppm/°C; 08 Manufacturer: Yageo; 13 Reviewed By: P.Moutzouris; 06 Package: 0603; 12 Author: D.Grace; 05 Footprint Type: SMD; 02 Part Number: RC0603FR-071KL; 03 Description: Resistor, Thick Film, 0.1W, ±1%, ±100ppm/°C; 04 Value: 1k; 09 Digikey PN: 311-1.00KHRTR-ND; 01 Part Category: Resistor; ComponentLink1Description: Datasheet; ComponentLink1URL: L:\Datasheet\Resistor\PYu-RC0603_51_RoHS_L_4.pdf
R6 = RC0603FR-07100KL: Resistor, Thick Film, 0.1W, ±1%, ±100ppm/°C; 08 Manufacturer: Yageo; 13 Reviewed By: P.Moutzouris; 04 Value: 100k; 06 Package: 0603; 12 Author: D.Grace; 05 Footprint Type: SMD; 02 Part Number: RC0603FR-07100KL; 03 Description: Resistor, Thick Film, 0.1W, ±1%, ±100ppm/°C; 09 Digikey PN: 311-100KHRTR-ND; 01 Part Category: Resistor; ComponentLink1Description: Datasheet; ComponentLink1URL: L:\Datasheet\Resistor\PYu-RC0603_51_RoHS_L_4.pdf
R7 = CMP-007-0038-1: Resistor, Thick Film, 0.1W, ±1%, ±100ppm/°C; 02 Part Number: RC0603FR-071KL; 08 Manufacturer: Yageo; 13 Reviewed By: P.Moutzouris; 04 Value: 1k; 06 Package: 0603; 12 Author: D.Grace; 05 Footprint Type: SMD; 03 Description: Resistor, Thick Film, 0.1W, ±1%, ±100ppm/°C; 09 Digikey PN: 311-1.00KHRTR-ND; 01 Part Category: Resistor; ComponentLink1Description: Datasheet; ComponentLink1URL: L:\Datasheet\Resistor\PYu-RC0603_51_RoHS_L_4.pdf; Component Name: RC0603FR-071KL
R8 R9 R40_don't_populate = CMP-007-0038-1: Resistor, Thick Film, 0.1W, ±1%, ±100ppm/°C; 02 Part Number: RC0603FR-071KL; 08 Manufacturer: Yageo; 13 Reviewed By: P.Moutzouris; 06 Package: 0603; 12 Author: D.Grace; 05 Footprint Type: SMD; 03 Description: Resistor, Thick Film, 0.1W, ±1%, ±100ppm/°C; 09 Digikey PN: 311-1.00KHRTR-ND; 01 Part Category: Resistor; ComponentLink1Description: Datasheet; ComponentLink1URL: L:\Datasheet\Resistor\PYu-RC0603_51_RoHS_L_4.pdf; Component Name: RC0603FR-071KL
  R8 R40_don't_populate: 04 Value: 100r
  R9: 04 Value: 680k
TP3-TP15 TP104-TP107 = Test Point: as TP1 on sheet Power_CU Schematic
U1 = CMP-1344-00010-1: RS485/RS422 Transceiver, Fault Protected +/- 60 V, 3 to 5.5 V, 0 to 70 degC, 14-Pin SOIC (S-14), RoHS, Tube; Manufacturer: Linear Technology; Duplex: Full; Receiver Hysteresis: 25 mV; Fault Protected: +/- 60 V; Drivers: 1; fMAX: 250 kbps Min.; ComponentLink2URL: http://cds.linear.com/docs/en/datasheet/2862345fc.pdf; Mounting Technology: Surface Mount; ComponentLink3Description: Package Specification; RoHS: TRUE; Temperature Range: 0 to 70 degC; Packing: Tube; PartNumber: MAX13433; PackageVersion: Rev. G; ComponentLink1Description: Manufacturer URL; ComponentLink2Description: Datasheet; DatasheetVersion: Rev. C; ComponentLink3URL: http://cds.linear.com/docs/en/packaging/05081610_G_S14.pdf; VCC: 3 to 5.5 V; ComponentLink1URL: http://www.linear.com/; PackageDescription: 14-Pin Plastic Small Outline, Body 8.65 x 3.9 mm, Pitch 1.27 mm
U2 = CMP-0055-00649-2: Dual Rail-to-Rail Input/Output, 30V, Wide Voltage Range, High Output Operational Amplifier, 8-pin Narrow SOIC; Manufacturer: National Semiconductor; CompType: Amplifiers; PackageTopMarking: NSZXTT*LM733*2MA; PowerWise: N; DatasheetVersion: Apr-2008; ComponentLink1URL: http://www.national.com/ds/LM/LM7332.pdf; RevisionNote: Component URLs added; PackageVersion: revM, May-2009; PinCount: 8; PackageReference: M08A; Code_JEDEC: MS-012-AA; RoHS: Y; ComponentLink1Description: LM7332 Datasheet; ComponentLink3URL: http://www.national.com/packaging/folders/m08a.html; ComponentLink3Description: M08A Package Page; PackageDescription: SOIC Narrow, 4.9 x 3.9 x 1.45mm, 8 Lead, 1.27mm Pitch; ComponentLink2Description: LM7332 Web Page; ComponentLink2URL: http://www.national.com/pf/LM/LM7332.html; Code_IPC: SOIC127P600-8
U3 = CMP-0944-00051-2: Precision, Low Drift, CMOS Instrumentation Amplifier, -40 to 85 degC, 8-pin SOP (DGK8), Green (RoHS & no Sb/Br); Manufacturer: Texas Instruments; SubFamily: Single Supply; Quiescent Current (+/-)(Typ)(mA): 2.4; Vs(Min)(V): 2.7; Gain(V/V): Less than 0.1 to Greater than 1000; Non-Linearity (+/-)(Max)(%): 0.01; Number of Channels: 1; Input Bias Current (+/-)(Max)(nA): 2; Input Offset Drift (+/-)(Max)(uV/Degrees Celsius): 0.4; Vs(Max)(V): 5.5; CMRR(Min)(dB): 100; Noise at 1kHz(Typ)(nV/rt(Hz)): 33; Eco-Plan: Green (RoHS & no Sb/Br); Code_JEDEC: MO-187; PackageVersion: 4073329/E, 05/2006; PackageDescription: 8-Pin Thin Small Outline, Body 3 x 3 mm, Pitch 0.65 mm; ComponentLink3Description: Package Specification; ComponentLink3URL: http://www.ti.com/litv/pdf/mpds028d; ComponentLink2URL: http://www.ti.com/general/docs/lit/getliterature.tsp?genericPartNumber=INA326&fileType=pdf; PartNumber: INA326EA/250; DatasheetVersion: SBOS222D; PackageReference: DGK0008A; ComponentLink1URL: http://www.ti.com/; ComponentLink1Description: Manufacturer URL; ComponentLink2Description: Datasheet; Mounting Technology: Surface Mount; Input Offset (+/-)(Max)(uV): 100

## Sheet PUMP DRIVER Schematic.SchDoc: Title
size A3; Date: *******; ApprovedBy: *******; CheckedBy: None; Author: *******; CompanyName: *******; DrawnBy: Name; Engineer: *******; Organization: *******; Address1: *******; Address2: *******; Address3: *******; Address4: *******; DocumentNumber: Doc Num; Revision: *******; SheetNumber: 1; SheetTotal: *******; CurrentTime: *******; CurrentDate: *******; Time: *******; DocumentFullPathAndName: *******; DocumentName: *******; ModifiedDate: *******; ImagePath: *******; ProjectName: *******; Application_BuildNumber: *******
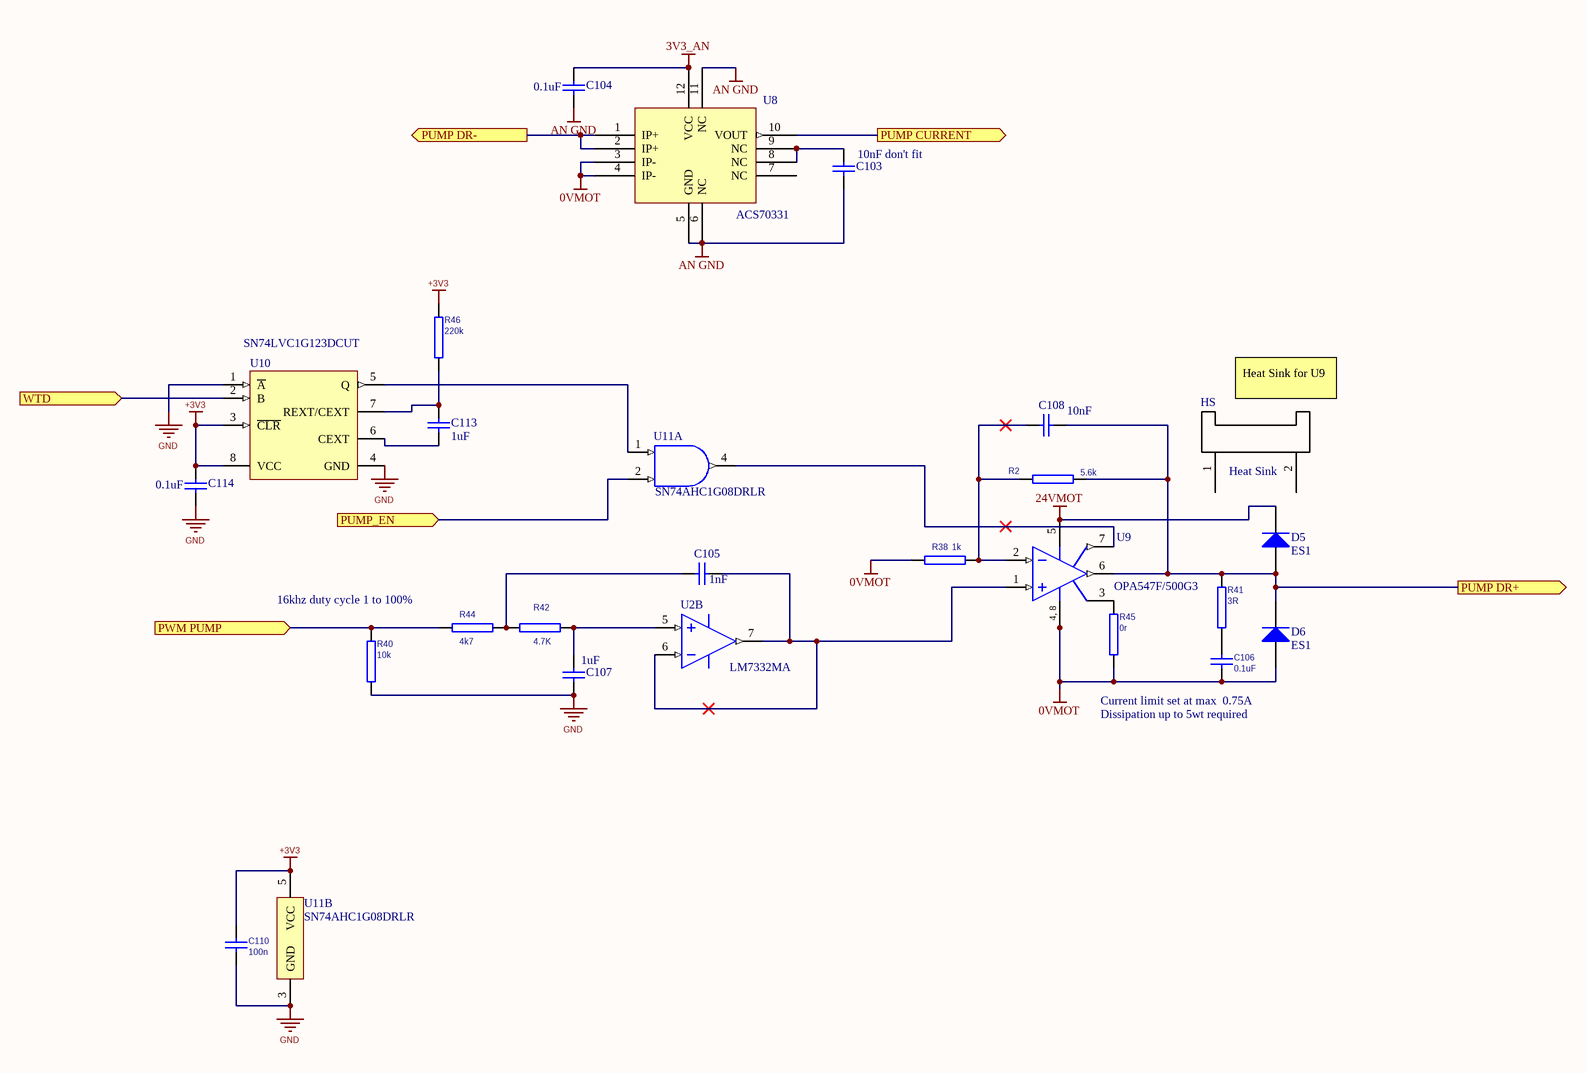
[diagram p6: PUMP DRIVER Schematic.SchDoc]

### Parts
C103  value 10nF don't fit  [C0805]  (hidden comment: Cap Semi)
C104  value 0.1uF  [C0805]  (hidden comment: Cap Semi)
C105  value 1nF  [CAPC1608X09N(0603)]  (hidden comment: Cap Semi)
C106  0.1uF  [CAPC1608X09N(0603)]
C107  value 1uF  [CAPC1608X09N(0603)]  (hidden comment: Cap Semi)
C108  value 10nF  [CAPC1608X09N(0603)]  (hidden comment: Cap Semi)
C110  100n  [CAPC1608X09N(0603)]
C113  value 1uF  [CAPC1608X09N(0603)]  (hidden comment: Cap Semi)
C114  value 0.1uF  [C0805]  (hidden comment: Cap Semi)
D5  ES1  [SMB]
D6  ES1  [SMB]
HS  Heat Sink  [ATS-PCB1073_heat_sink_D2PACK]
R2  5.6k  [RESC1608X06N(0603)]
R38  1k  [RESC1608X06N(0603)]
R40  10k  [RESC1608X06N(0603)]
R41  3R  [RESC1608X06N(0603)]
R42  4.7K  [RESC1608X06N(0603)]
R44  4k7  [RESC1608X06N(0603)]
R45  0r  [RESC1608X06N(0603)]
R46  220k  [RESC1608X06N(0603)]
U2  LM7332MA  [M08A_N]  (part B of 2)
U8  ACS70331  [Quad12]
U9  OPA547F/500G3  [TS7B_N]
U10  SN74LVC1G123DCUT  [DCU0008A_N]
U11  SN74AHC1G08DRLR  [DRL0005A_L]  (parts A,B of 2)

### Ports
PUMP CURRENT (out), PUMP DR+ (out), PUMP DR- (out), PUMP_EN (in), PWM PUMP (in), WTD (in)

### Nets
0VMOT: C106.2 D6.1(A) R38.1 R45.1 U8.3(IP-) U8.4(IP-) U9.4(V-) U9.8(V-)
3V3_AN: C104.2 U8.12(VCC)
24VMOT: D5.2(K) U9.5(V+)
+3V3: C110.1 C114.2 R46.2 U10.3(~{CLR}) U10.8(VCC) U11.5(VCC)
AN GND: C103.1 C104.1 C107.1 C110.2 C114.1 R40.1 U8.5(GND) U8.6(NC) U8.11(NC) U10.1(~{A}) U10.4(GND) U11.3(GND)  [also labelled GND]
NetC103_2: C103.2 U8.8(NC) U8.9(NC)
NetC105_1: C105.1 R42.1 R44.2
NetC105_2: C105.2 U2.6(INB-) U2.7(OUTB) U9.1(IN+)
NetC106_1: C106.1 R41.1
NetC107_2: C107.2 R42.2 U2.5(INB+)
NetC108_1: C108.1 D5.1(A) D6.2(K) R2.2 R41.2 U9.6(OUT) ; port PUMP DR+
NetC108_2: C108.2 R2.1 R38.2 U9.2(IN-)
NetC113_1: C113.1 R46.1 U10.7(REXT/CEXT)
NetC113_2: C113.2 U10.6(CEXT)
NetJ6_1: U8.1(IP+) U8.2(IP+) ; port PUMP DR-
NetR40_2: R40.2 R44.1 ; port PWM PUMP
NetR45_2: R45.2 U9.3(CUR_LIM)
NetU4_20: U10.2(B) ; port WTD
NetU4_21: U11.2(B) ; port PUMP_EN
NetU4_79: U8.10(VOUT) ; port PUMP CURRENT
NetU9_7: U9.7(E/S) U11.4(Y)
NetU10_5: U10.5(Q) U11.1(A)

Not connected (* = marked no-connect by the designer): HS 1 2; U8 7(NC)

### Notes on the sheet
- Heat Sink for U9
- 16khz duty cycle 1 to 100%
- Current limit set at max  0.75A
- Dissipation up to 5wt required
- Title:
- Drawn By:
- Page Contents:
- Ahmed - AA
- Checked By:
- Size:
- Date:
- File:
- License:
- Email:
- A4
- Number:
- Time:
- Revision:
- Sheet
- Website:
- of
- (in symbol CMP-0272-04175-1) 4, 8

### Library data of the parts
C103-C105 C107 C108 C113 C114 = Cap Semi: Capacitor (Semiconductor SIM Model); Published: 8-Jun-2000; LatestRevisionDate: 29-May-2009; LatestRevisionNote: IPC-7351 Footprint Added.; Publisher: Altium Limited; PackageDescription: Chip Capacitor
  C103 C104 C114: PackageReference: C1206
  C105 C107 C108 C113: PackageReference: 0603
C106 = GRM1885C1H102JA01D: Capacitor, Ceramic, 50V, ±5%, C0G NP0, -55°C to 125°C; 08 Manufacturer: Murata Electronics North America; 06 Package: 0603; 12 Author: D.Grace; 05 Footprint Type: SMD; 02 Part Number: GRM1885C1H102JA01D; 03 Description: Capacitor, Ceramic, 50V, ±5%, C0G NP0, -55°C to 125°C; 04 Value: 0.1uF; 01 Part Category: Capacitor; ComponentLink1Description: Datasheet; ComponentLink1URL: L:\Datasheet\Capacitor\c02e.pdf
C110 = GRM188R71H104KA93D: Capacitor, Ceramic, 50V, ±10%, X7R, -55°C to 125°C; 08 Manufacturer: Murata Electronics North America; 06 Package: 0603; 12 Author: D.Grace; 05 Footprint Type: SMD; 02 Part Number: GRM188R71H104KA93D; 03 Description: Capacitor, Ceramic, 50V, ±10%, X7R, -55°C to 125°C; 04 Value: 100n; 01 Part Category: Capacitor; 09 Digikey PN: 490-1519-2-ND; ComponentLink1Description: Datasheet; ComponentLink1URL: L:\Datasheet\Capacitor\c02e.pdf
D5 D6 = Diode: Default Diode; Published: 8-Jun-2000; LatestRevisionDate: 17-Jul-2002; LatestRevisionNote: Re-released for DXP Platform.; PackageVersion: Sep-1996; PackageReference: SMC; Publisher: Altium Limited; PackageDescription: DO-214-AB/SMC; 2 C-Bend Leads; Body 7.9 x 5.9 mm, inc. leads (LxW); Code_JEDEC: DO-214-AB
R2 R40 R44 = RC0603FR-07100RL: Resistor, Thick Film, 0.1W, ±1%, ±100ppm/°C; 08 Manufacturer: Yageo; 13 Reviewed By: P.Moutzouris; 06 Package: 0603; 12 Author: D.Grace; 05 Footprint Type: SMD; 02 Part Number: RC0603FR-07100RL; 03 Description: Resistor, Thick Film, 0.1W, ±1%, ±100ppm/°C; 01 Part Category: Resistor; ComponentLink1Description: Datasheet; ComponentLink1URL: L:\Datasheet\Resistor\PYu-RC0603_51_RoHS_L_4.pdf
  R2: 04 Value: 5.6k; 09 Digikey PN: 311-5.6KNTR-ND
  R40: 04 Value: 10k; 09 Digikey PN: 311-10KNTR-ND
  R44: 04 Value: 4k7; 09 Digikey PN: 311-4.7KNTR-ND
R38 = RC0603FR-07100RL: Resistor, Thick Film, 0.1W, ±1%, ±100ppm/°C; 08 Manufacturer: Yageo; 13 Reviewed By: P.Moutzouris; 04 Value: 100R; 06 Package: 0603; 12 Author: D.Grace; 05 Footprint Type: SMD; 02 Part Number: RC0603FR-07100RL; 03 Description: Resistor, Thick Film, 0.1W, ±1%, ±100ppm/°C; 09 Digikey PN: 311-100HRTR-ND; 01 Part Category: Resistor; ComponentLink1Description: Datasheet; ComponentLink1URL: L:\Datasheet\Resistor\PYu-RC0603_51_RoHS_L_4.pdf
R41 = CMP-007-0038-1: Resistor, Thick Film, 0.1W, ±1%, ±100ppm/°C; 02 Part Number: RC0603FR-071KL; 08 Manufacturer: Yageo; 13 Reviewed By: P.Moutzouris; 06 Package: 0603; 12 Author: D.Grace; 05 Footprint Type: SMD; Component Name: ERJ-8BQF3ROV; 03 Description: Resistor, Thick Film, 0.1W, ±1%, ±100ppm/°C; 04 Value: 3r; 09 Digikey PN: P17611TR-ND; 01 Part Category: Resistor; ComponentLink1Description: Datasheet; ComponentLink1URL: L:\Datasheet\Resistor\PYu-RC0603_51_RoHS_L_4.pdf
R42 = RC0603FR-07100RL: Resistor, Thick Film, 0.1W, ±1%, ±100ppm/°C; 08 Manufacturer: Yageo; 13 Reviewed By: P.Moutzouris; 04 Value: 4k7; 06 Package: 0603; 12 Author: D.Grace; 05 Footprint Type: SMD; 02 Part Number: RC0603FR-07100RL; 03 Description: Resistor, Thick Film, 0.1W, ±1%, ±100ppm/°C; 09 Digikey PN: 311-4.7KNTR-ND; 01 Part Category: Resistor; ComponentLink1Description: Datasheet; ComponentLink1URL: L:\Datasheet\Resistor\PYu-RC0603_51_RoHS_L_4.pdf
R45 = RC0603FR-07100RL: Resistor, Thick Film, 0.1W, ±1%, ±100ppm/°C; 08 Manufacturer: Yageo; 13 Reviewed By: P.Moutzouris; 04 Value: 15k; 06 Package: 0603; 12 Author: D.Grace; 05 Footprint Type: SMD; 02 Part Number: RC0603FR-07100RL; 03 Description: Resistor, Thick Film, 0.1W, ±1%, ±100ppm/°C; 09 Digikey PN: 311-15KNTR-ND; 01 Part Category: Resistor; ComponentLink1Description: Datasheet; ComponentLink1URL: L:\Datasheet\Resistor\PYu-RC0603_51_RoHS_L_4.pdf
R46 = RC0603FR-07100RL: Resistor, Thick Film, 0.1W, ±1%, ±100ppm/°C; 08 Manufacturer: Yageo; 13 Reviewed By: P.Moutzouris; 04 Value: 5.6k; 06 Package: 0603; 12 Author: D.Grace; 05 Footprint Type: SMD; 02 Part Number: RC0603FR-07100RL; 03 Description: Resistor, Thick Film, 0.1W, ±1%, ±100ppm/°C; 09 Digikey PN: 311-5.6KNTR-ND; 01 Part Category: Resistor; ComponentLink1Description: Datasheet; ComponentLink1URL: L:\Datasheet\Resistor\PYu-RC0603_51_RoHS_L_4.pdf
U2 = CMP-0055-00649-2: Dual Rail-to-Rail Input/Output, 30V, Wide Voltage Range, High Output Operational Amplifier, 8-pin Narrow SOIC; Manufacturer: National Semiconductor; CompType: Amplifiers; PackageTopMarking: NSZXTT*LM733*2MA; PowerWise: N; DatasheetVersion: Apr-2008; ComponentLink1URL: http://www.national.com/ds/LM/LM7332.pdf; RevisionNote: Component URLs added; PackageVersion: revM, May-2009; PinCount: 8; PackageReference: M08A; Code_JEDEC: MS-012-AA; RoHS: Y; ComponentLink1Description: LM7332 Datasheet; ComponentLink3URL: http://www.national.com/packaging/folders/m08a.html; ComponentLink3Description: M08A Package Page; PackageDescription: SOIC Narrow, 4.9 x 3.9 x 1.45mm, 8 Lead, 1.27mm Pitch; ComponentLink2Description: LM7332 Web Page; ComponentLink2URL: http://www.national.com/pf/LM/LM7332.html; Code_IPC: SOIC127P600-8
U8 = ASC70331
U9 = CMP-0272-04175-1: High-Voltage, High-Current Operational Amplifier, 8 to 60 V, -55 to 125 degC, 7-Pin DDPAK (KTW), Green (RoHS & no Sb/Br), Tape and Reel; PartNumber: OPA547; Supply Voltage Min: 8 V; Number of Channels: 1; Slew Rate: 24 V/us; Gain Bandwidth: 12 MHz; Supply Voltage Max: 60 V; ComponentLink2URL: http://www.ti.com/lit/ds/symlink/opa547.pdf; PackageVersion: 4201284/A, 08/2001; ComponentLink1Description: Manufacturer URL; ComponentLink3Description: Package Specification; Temperature Min: -55 degC; PackageDescription: 7-Pin Plastic Flange Mount, Body 8.89 x 10.1 mm, Pitch 1.27 mm; DatasheetVersion: SBOS100A; RoHS: TRUE; ComponentLink2Description: Datasheet; ComponentLink1URL: http://www.ti.com/; Mounting Technology: Surface Mount; Packing: Tape and Reel; Temperature Max: 125 degC; ComponentLink3URL: http://www.ti.com/litv/pdf/mpsf015; Code_JEDEC: MO-169
U10 = CMP-0859-00695-3: Single Retriggerable Monostable Multivibrator with Schmitt-Trigger Inputs, DCU0008A, SMALL T&R; Manufacturer: Texas Instruments; Schmitt Trigger: Yes; Logic: True; ICC @ Nom Voltage(Max)(mA): 0.02; VCC(Max)(V): 5.5; Output Type: CMOS; Technology Family: LVC; Bits(#): 1; Rating: Catalog; F @ Nom Voltage(Max)(Mhz): 150; VCC(Min)(V): 1.65; 3-State Output: No; tpd @ Nom Voltage(Max)(ns): 34,11,8,5.5; Output Drive (IOL/IOH)(Max)(mA): 32/-32; Input Type: CMOS/TTL; Voltage(Nom)(V): 1.8,2.5,3.3,5; DatasheetVersion: SCES586C; PackageReference: DCU0008A; Operating Temperature Range(C): -40 to 125,-40 to 85; Generic Part Number: SN74LVC1G123; Sub-Family: Monostable Multivibrator; Specialty Logic Family: Monostable Multivibrator
U11 = CMP-0859-00800-3: Single 2-Input Positive-AND Gate, DRL0005A, LARGE T&R; Manufacturer: Texas Instruments; tpd @ Nom Voltage(Max)(ns): 12.3,7.9; Bits(#): 1; Voltage(Nom)(V): 3.3,5; Output Type: CMOS; VCC(Min)(V): 2; VCC(Max)(V): 5.5; ICC @ Nom Voltage(Max)(mA): 0.01; Rating: Catalog; Gate Type: AND; Technology Family: AHC; Schmitt Trigger: No; Logic: True; F @ Nom Voltage(Max)(Mhz): 75; Output Drive (IOL/IOH)(Max)(mA): 50/-50; Generic Part Number: SN74AHC1G08; DatasheetVersion: SCLS314N; Input Type: CMOS; Operating Temperature Range(C): -55 to 125; Sub-Family: AND Gate; PackageReference: DRL0005A; 3-State Output: No

## Nets that join several sheets
0VMOT: Power_CU Schematic (C102.1 CM2.3 R49.2), PUMP DRIVER Schematic (8 pins)
3V3_AN: MCU_CU Schematic (6 pins), Connector_CU Schematic (9 pins), PUMP DRIVER Schematic (C104.2 U8.12)
24VMOT: Power_CU Schematic (C102.2 CM2.4 R1.2 TP1.TP), PUMP DRIVER Schematic (D5.2 U9.5)
+3V3: RFID_CU Schematic (C60.2 C88.2 FB4.1 R34.2), MCU_CU Schematic (C9.2 FB3.1), Power_CU Schematic (R15.2 TP55.TP TP62.TP), Connector_CU Schematic (6 pins), PUMP DRIVER Schematic (6 pins)
+5V: RFID_CU Schematic (C65.2 FB5.1), Power_CU Schematic (R22.2 TP70.TP TP74.TP)
AN GND: RFID_CU Schematic (52 pins), MCU_CU Schematic (29 pins), Power_CU Schematic (42 pins), Connector_CU Schematic (20 pins), PUMP DRIVER Schematic (12 pins)
0VIN: Power_CU Schematic (6 pins), Connector_CU Schematic (C2.1 J1.1 J1.3)
+24VIN: Power_CU Schematic (8 pins), Connector_CU Schematic (C2.2 FB1.1)
NetC3_1: MCU_CU Schematic (U4.17), Connector_CU Schematic (C3.1 R4.2 TP13.TP)
NetC8_1: MCU_CU Schematic (U4.77), Connector_CU Schematic (C8.1 R8.2 TP105.TP)
NetC85_2: RFID_CU Schematic (C85.2 C86.2 TP93.TP U7.11), MCU_CU Schematic (U4.78)
NetC99_1: MCU_CU Schematic (U4.80), Connector_CU Schematic (C99.1 R40_don't_populate.2 TP104.TP)
NetC108_1: Connector_CU Schematic (J6.2), PUMP DRIVER Schematic (6 pins)
NetJ6_1: Connector_CU Schematic (J6.1), PUMP DRIVER Schematic (U8.1 U8.2)
NetR40_2: MCU_CU Schematic (U4.19), PUMP DRIVER Schematic (R40.2 R44.1)
NetTP3_TP: MCU_CU Schematic (U4.56), Connector_CU Schematic (TP3.TP TP4.TP U1.5)
NetTP5_TP: MCU_CU Schematic (U4.57), Connector_CU Schematic (TP5.TP TP6.TP U1.2)
NetU4_20: MCU_CU Schematic (U4.20), PUMP DRIVER Schematic (U10.2)
NetU4_21: MCU_CU Schematic (U4.21), PUMP DRIVER Schematic (U11.2)
NetU4_79: MCU_CU Schematic (U4.79), PUMP DRIVER Schematic (U8.10)
RFID_ASK_OOK: RFID_CU Schematic (C83.1 U7.12), MCU_CU Schematic (TP28.TP U4.28)
RFID_CLK: RFID_CU Schematic (R29.2 R30.2), MCU_CU Schematic (C14.1 R13.2 TP23.TP)
RFID_EN: RFID_CU Schematic (C63.1 R28.2 U7.28), MCU_CU Schematic (TP29.TP U4.25)
RFID_IRQ: RFID_CU Schematic (U7.13), MCU_CU Schematic (C16.2 U4.34)
RFID_LED_EN: RFID_CU Schematic (Q1.G R35.2), MCU_CU Schematic (U4.18)
RFID_MISO: RFID_CU Schematic (R33.2), MCU_CU Schematic (C15.1 R12.2 TP21.TP)
RFID_MOD: RFID_CU Schematic (C84.1 U7.14), MCU_CU Schematic (TP26.TP U4.27)
RFID_MOSI: RFID_CU Schematic (R31.2), MCU_CU Schematic (C13.1 R11.2 TP19.TP)
RFID_SS: RFID_CU Schematic (C79.1 U7.21), MCU_CU Schematic (TP18.TP U4.26)